# EAGLE design 2021-02-18_HALO_Accel_Board (EAGLE 9.6.2)
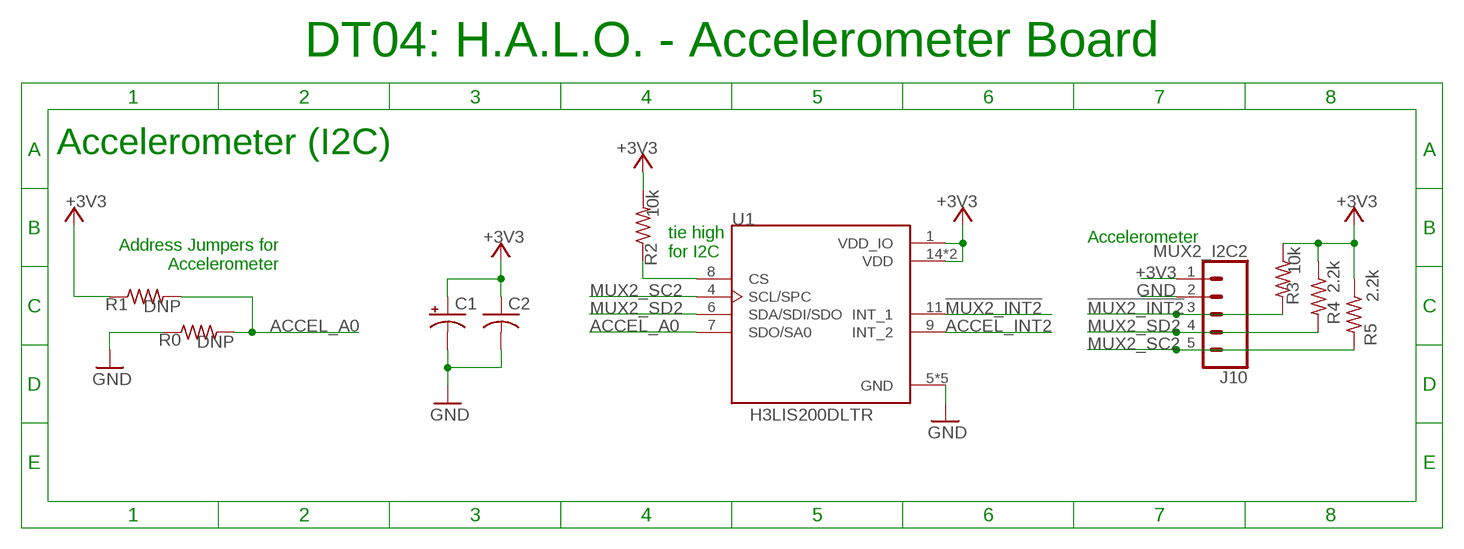
[diagram p0: schematic, sheet 1]

## Parts
C1  10uF  10UF-POLAR-EIA3216-16V-10%(TANT)  [EIA3216]
C2  0.1uF  C-USC0805  [C0805]
J10  MUX2_I2C2  CONN_05  [1X05]
R0  DNP  R-US_R0805  [R0805]
R1  DNP  R-US_R0805  [R0805]
R2  10k  R-US_R0805  [R0805]
R3  10k  R-US_R0805  [R0805]
R4  2.2k  R-US_R0805  [R0805]
R5  2.2k  R-US_R0805  [R0805]
U1  H3LIS200DLTR  [PQFN50P300X300X100-16N]

## Nets
!MUX2_INT2: J10.3 R3.2 U1.11(INT_1)
+3V3: C1.+ C2.1 J10.1 R1.1 R2.2 R3.1 R4.1 R5.1 U1.1(VDD_IO) U1.14(VDD) U1.15(VDD)
ACCEL_A0: R0.2 R1.2 U1.7(SDO/SA0)
ACCEL_INT2: U1.9(INT_2)
GND: C1.- C2.2 J10.2 R0.1 U1.5(GND) U1.10(GND) U1.12(GND) U1.13(GND) U1.16(GND)
MUX2_SC2: J10.5 R5.2 U1.4(SCL/SPC)
MUX2_SD2: J10.4 R4.2 U1.6(SDA/SDI/SDO)
N$1: R2.1 U1.8(CS)

## Notes on the sheet
- DT04: H.A.L.O. - Accelerometer Board
- Accelerometer (I2C)
- Accelerometer
- tie high
  for I2C
- Address Jumpers for
  Accelerometer

## Library data of the parts
C1 = SparkFun-Capacitors:10UF-POLAR: 10.0µF polarized capacitors A capacitor is a passive two-terminal electrical component used to store electrical energy temporarily in an electric field.; PROD_ID: CAP-00811
C2 = rcl:C-US: CAPACITOR, American symbol
J10 = SparkFun-Connectors:CONN_05: Multi connection point. Often used as Generic Header-pin footprint for 0.1 inch spaced/style header connections On any of the 0.1 inch spaced packages, you can populate with these: Break Away Headers - Straight <https://www.sparkfun.com/products/116> (PRT-00116) Break Away Male Headers - Right Angle <https://www.sparkfun.com/products/553> (PRT-00553) Female Headers <https://www.sparkfun.com/products/115> (PRT-00115) Break Away Headers - Machine Pin <https://www.sparkfun.com/products/117> (PRT-00117) Break Away Female Headers - Swiss Machine Pin <https://www.sparkfun.com/products/743> (PRT-00743) For SCREWTERMINALS and SPRING TERMINALS visit here: Screw Terimnals on SparkFun.com <https://www.sparkfun.com/search/results?term=Screw+Terminals> (5mm/3.5mm/2.54mm spacing) This device is also useful as a general connection point to wire up your design to another part of your project. Our various solder wires solder well into these plated through hole pads. Hook-Up Wire - Assortment (Stranded, 22 AWG) <https://www.sparkfun.com/products/11375> (PRT-11375) Hook-Up Wire - Assortment (Solid Core, 22 AWG) <https://www.sparkfun.com/products/11367> (PRT-11367) View the entire wire category on our website here <https://www.sparkfun.com/categories/141> Special notes: Molex polarized connector foot print use with SKU : PRT-08231 with associated crimp pins and housings. 1MM SMD Version SKU: PRT-10208
R0 R1-R5 = rcl:R-US_: RESISTOR, American symbol
U1 = H3LIS200DLTR:H3LIS200DLTR: H3LIS200DL Series 3.6 V 400 Hz Low-Power 3-Axis Digital Accelerometer -TFLGA-16L; DESCRIPTION: Accelerometer X, Y, Z Axis ±100g, ±200g 25Hz ~ 500Hz 16-TFLGA (3x3); DIGI-KEY_PART_NUMBER: 497-15698-1-ND; MF: STMicroelectronics; MP: H3LIS200DLTR; PACKAGE: TFLGA-16 STMicroelectronics; PURCHASE-URL: https://pricing.snapeda.com/search/part/H3LIS200DLTR/?ref=eda

## Board
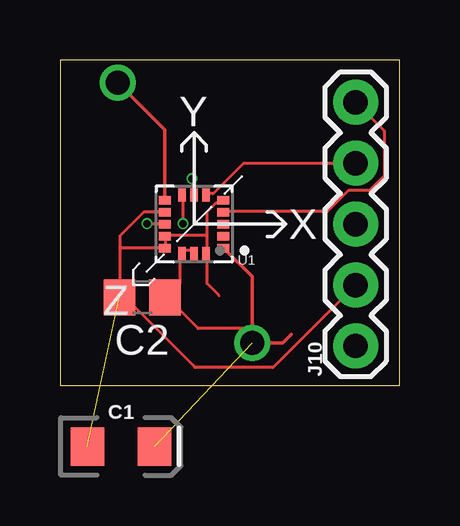
[diagram p1: board, top side]
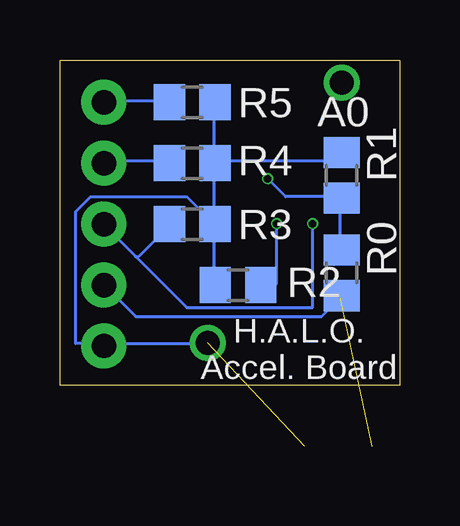
[diagram p2: board, bottom side, seen from below]

Size 14.15 x 13.58 mm. Coordinates in mm from the lower left corner, seen from the top.
Outline: 0,0 14.15,0 14.15,13.58 0,13.58 0,0
Copper layers (1*16): Top 0.035559375mm / dielectric 1.6mm / Bottom 0.035559375mm
Design rules "jlcpcb2layer": minimum track width 5mil, minimum drill 12mil, track to track 5mil, track to pad 5mil, pad to pad 5mil, via to via 5mil, smd to smd 5mil, copper to edge 8mil, drill to drill 6mil, minimum pad ring 5mil, minimum via ring 3mil, stop-mask expansion 2.5mil, vias tented up to drill 0mil, thermal gap 10mil

### Footprints (pad centres in the part's own frame; a part is rotated, then mirrored left to right if it is on the bottom)
EIA3216 = smd 1.4 x 1.6: + 1.4,0; - -1.4,0
C0805 = smd 1.3 x 1.5: 1 -0.95,0; 2 0.95,0
1X05 = drill 1.016 pad 1.88: 1 0,0; 2 2.54,0; 3 5.08,0; 4 7.62,0; 5 10.16,0
R0805 = smd 1.3 x 1.5: 1 -0.95,0; 2 0.95,0
PQFN50P300X300X100-16N = smd 0.53 x 0.35: 1 -1.22,1; 2 -1.22,0.5; 3 -1.22,0; 4 -1.22,-0.5; 5 -1.22,-1; 9 1.22,-1; 10 1.22,-0.5; 11 1.22,0; 12 1.22,0.5; 13 1.22,1 | smd 0.35 x 0.53: 6 -0.5,-1.22; 7 0,-1.22; 8 0.5,-1.22; 14 0.5,1.22; 15 0,1.22; 16 -0.5,1.22

### Placement (x,y rotation side)
C1  2.54,-2.54 0 top
C2  3.43,3.68 180 top
J10  12.32,1.65 90 top
R0  2.41,4.7 90 bottom
R1  2.41,8.76 270 bottom
R2  6.73,4.19 180 bottom
R3  8.64,6.73 180 bottom
R4  8.64,9.27 180 bottom
R5  8.64,11.81 180 bottom
U1  5.59,6.73 180 top

### Tracks (layer width: path | path; a pad name or v marks a point on that pad's centre or on a via)
!MUX2_INT2  (via drill 0.3)
  Top 0.127: v3.62,6.75 4.25,6.75 U1.11
  Bottom 0.127: v3.62,6.75 3.62,3.25 8.88,3.25 11,5.38 | 11,5.38 12.25,6.62 J10.3 | 11,5.38 10.88,5.38 9.62,6.62 R3.2
+3V3  (via drill 1)  (1 unrouted)
  Top 0.127: U1.15 5.5,5.62 5.12,5.62 U1.14 5,5.5 5,4.25 4.5,3.75 C2.1 4.5,3.62 5.75,2.38 8,2.38 v8,1.78
  Top 0.152: U1.1 8,4.54 v8,1.78 9.27,1.78 9.63,2.13
  Bottom 0.127: R2.2 7.75,4.25 7.75,6.62 R3.1 7.75,6.75 | R4.1 7.75,9.38 7.75,11.75 R5.1 | R1.1 2.5,9.62 2.75,9.38 7.62,9.38 R4.1 | 7.75,6.75 7.75,9.25 R4.1 | v8,1.78 8.12,1.75 12.25,1.75 J10.1 12.38,1.75 13.5,1.75 13.5,7.25 12.88,7.88 8.88,7.88 7.75,6.75
ACCEL_A0  (via drill 0.3)
  Top 0.127: v5.5,8.62 5.5,8 U1.7
  Bottom 0.127: v5.5,8.62 4.75,7.88 2.5,7.88 R1.2 2.5,7.75 2.5,5.75 R0.2
ACCEL_INT2  (via drill 1)
  Top 0.152: U1.9 4.37,10.67 v2.41,12.63
GND  (1 unrouted)
  Top 0.127: 2.5,5.75 2.5,3.75 C2.2 2.5,3.62 2.75,3.62 5.62,0.75 8.88,0.75 12.25,4.12 J10.2 | 2.5,5.75 2.5,6.25 3.5,7.25 4.25,7.25 U1.10 | 2.5,5.75 4.25,5.75 U1.13 4.38,5.75 4.38,6.12 U1.12 4.38,6.25 6.12,6.25 | 6.62,3.75 6.12,4.25 6.12,5.5 U1.16 6.12,5.62 6.12,6.25 | 6.12,6.25 6.12,7.25 6.5,7.62 6.75,7.62 U1.5
  Bottom 0.127: R0.1 2.5,3.62 3.25,2.88 11,2.88 12.25,4.12 J10.2
MUX2_SC2
  Top 0.127: U1.4 6.88,7.25 11.12,7.25 12,8.12 12.88,8.12 13.5,8.75 13.5,10.62 12.38,11.75 J10.5
  Bottom 0.127: R5.2 9.62,11.88 12.25,11.88 J10.5
MUX2_SD2
  Top 0.127: U1.6 6.12,8 6.38,8 7.62,9.25 12.25,9.25 J10.4
  Bottom 0.127: R4.2 9.62,9.38 12.25,9.38 J10.4
N$1  (via drill 0.3)
  Top 0.127: v5.12,6.75 5.12,7.88 U1.8
  Bottom 0.127: v5.12,6.75 5.12,4.25 5.75,4.25 R2.1

### Text on the board
tNames: Y | X | Z
bNames: A0 | H.A.L.O. / Accel. Board